# Altium schematic sheet PCIE-to-USB3.SchDoc
size A3
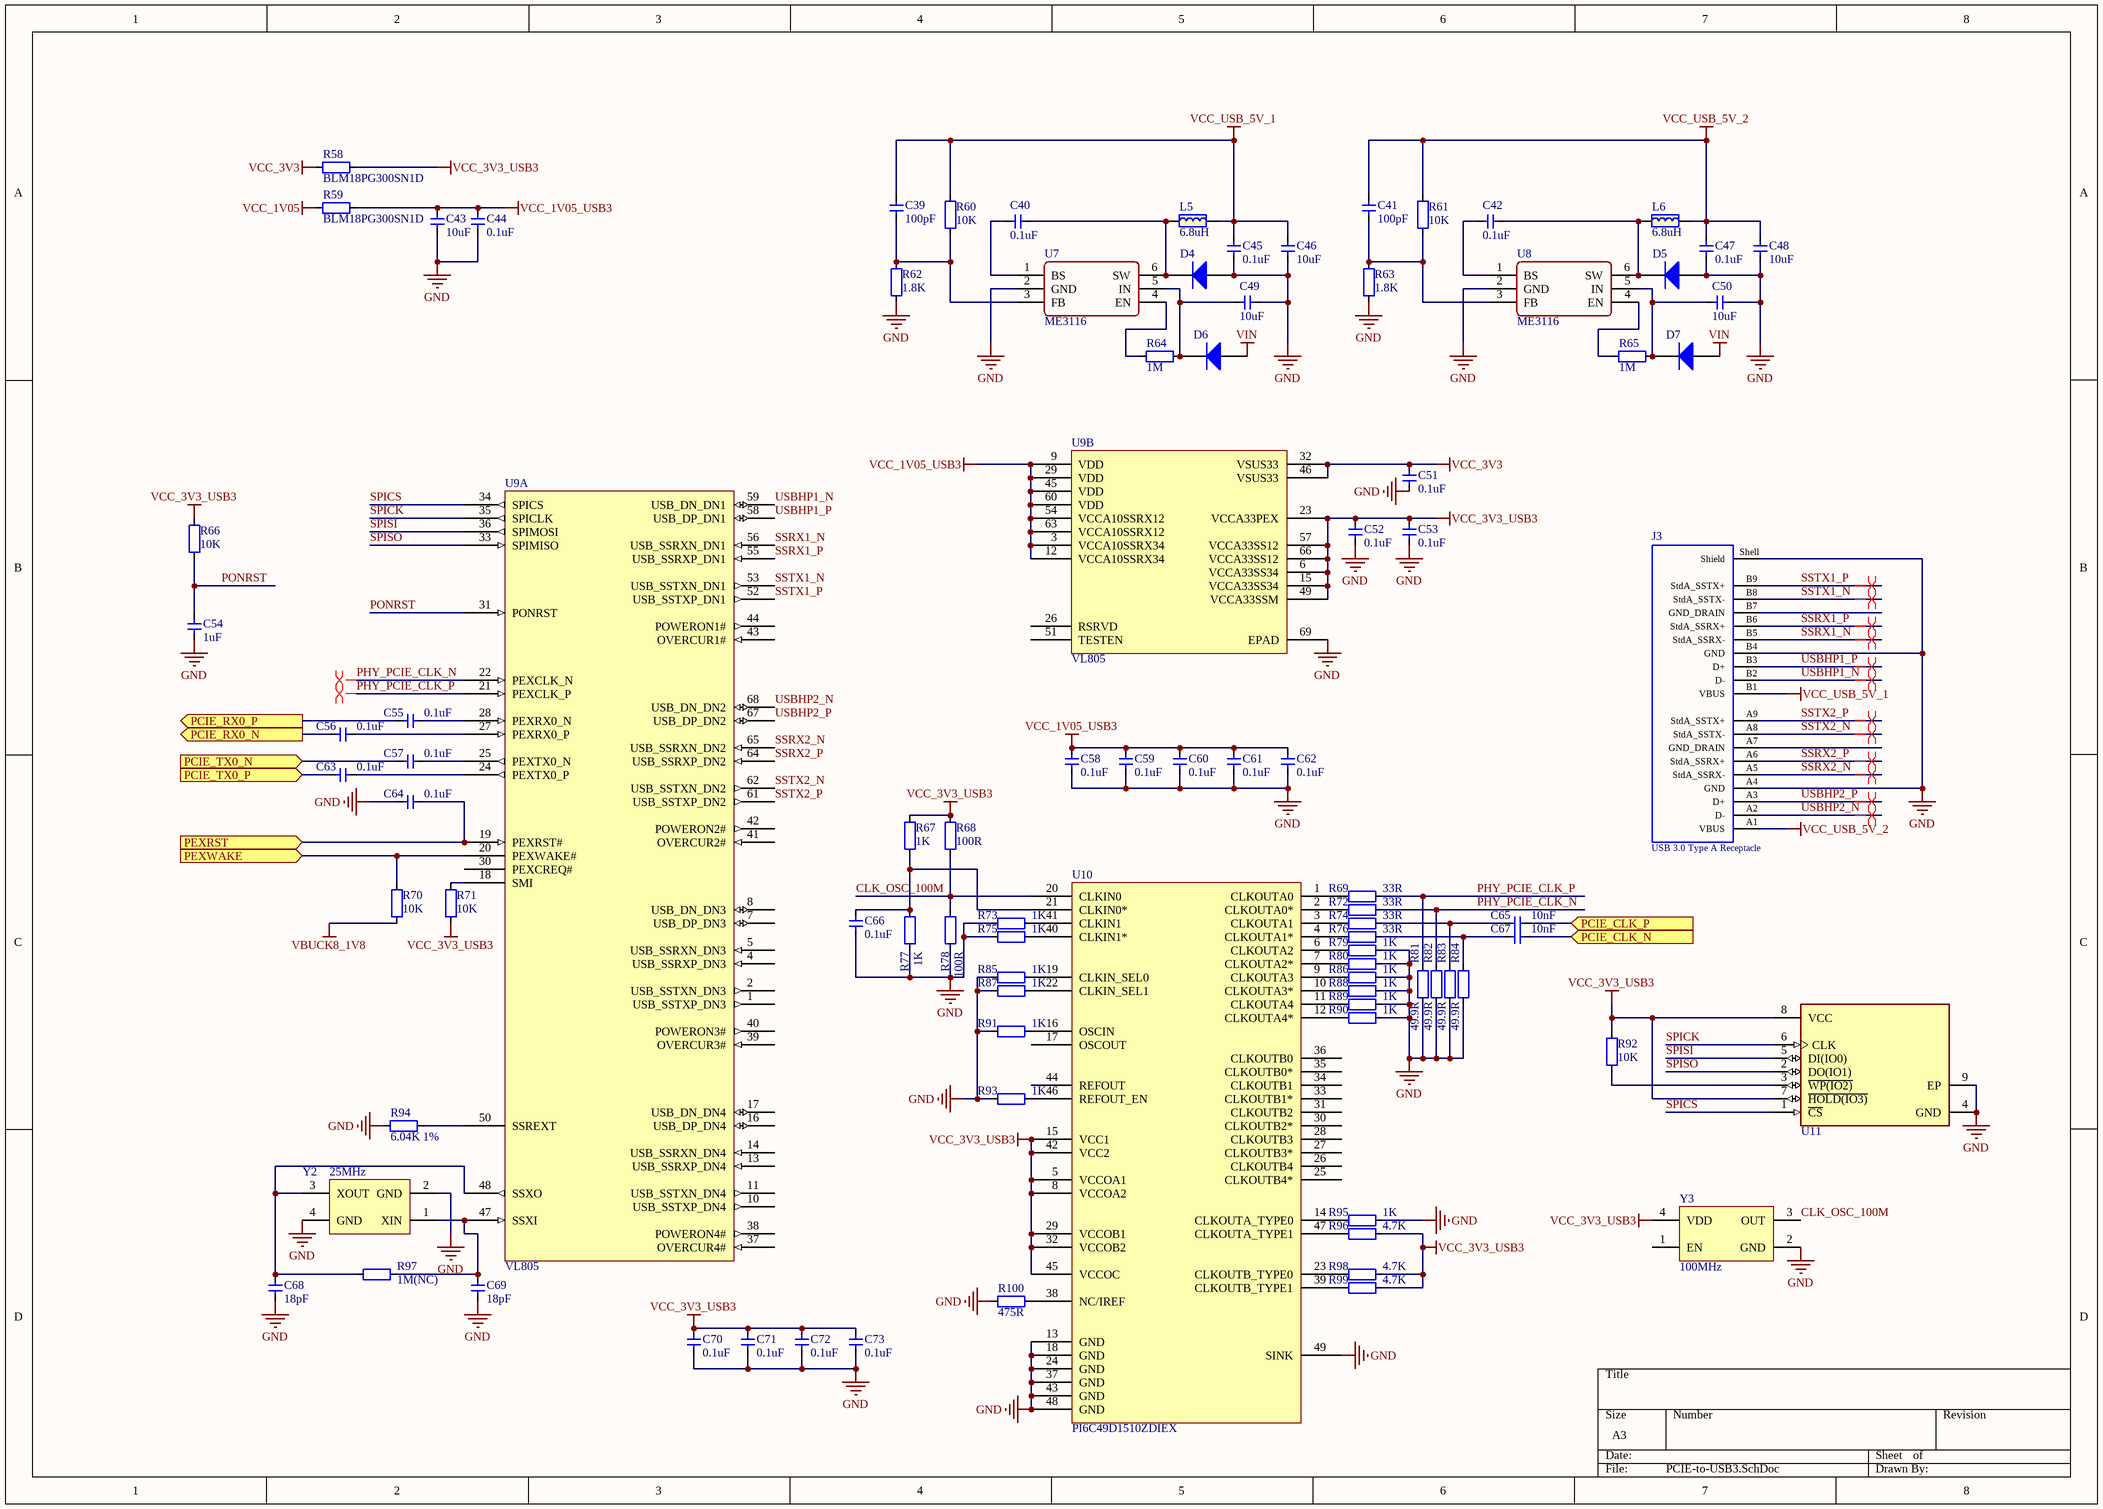
[diagram p0: PCIE-to-USB3.SchDoc]

## Parts
C39  100pF  [CAP_0402]
C40  0.1uF  [CAP_0402]
C41  100pF  [CAP_0402]
C42  0.1uF  [CAP_0402]
C43  10uF  [CAP_0402]
C44  0.1uF  [CAP_0402]
C45  0.1uF  [CAP_0402]
C46  10uF  [CAP_0402]
C47  0.1uF  [CAP_0402]
C48  10uF  [CAP_0402]
C49  10uF  [CAP_0402]
C50  10uF  [CAP_0402]
C51  0.1uF  [CAP_0402]
C52  0.1uF  [CAP_0402]
C53  0.1uF  [CAP_0402]
C54  1uF  [CAP_0402]
C55  0.1uF  [CAP_0402]
C56  0.1uF  [CAP_0402]
C57  0.1uF  [CAP_0402]
C58  0.1uF  [CAP_0402]
C59  0.1uF  [CAP_0402]
C60  0.1uF  [CAP_0402]
C61  0.1uF  [CAP_0402]
C62  0.1uF  [CAP_0402]
C63  0.1uF  [CAP_0402]
C64  0.1uF  [CAP_0402]
C65  10nF  [CAP_0402]
C66  0.1uF  [CAP_0402]
C67  10nF  [CAP_0402]
C68  18pF  [CAP_0402]
C69  18pF  [CAP_0402]
C70  0.1uF  [CAP_0402]
C71  0.1uF  [CAP_0402]
C72  0.1uF  [CAP_0402]
C73  0.1uF  [CAP_0402]
D4  二极管-5B5817WS  [SOD-323]  (value not drawn)
D5  二极管-5B5817WS  [SOD-323]  (value not drawn)
D6  二极管-5B5817WS  [SOD-323]  (value not drawn)
D7  二极管-5B5817WS  [SOD-323]  (value not drawn)
J3  USB 3.0 Type A Receptacle  [692141030100]
L5  6.8uH  [IND-201612]
L6  6.8uH  [IND-201612]
R58  BLM18PG300SN1D  [0603-RES]
R59  BLM18PG300SN1D  [0603-RES]
R60  10K  [RES_0402]
R61  10K  [RES_0402]
R62  1.8K  [RES_0402]
R63  1.8K  [RES_0402]
R64  1M  [RES_0402]
R65  1M  [RES_0402]
R66  10K  [RES_0402]
R67  1K  [RES_0402]
R68  100R  [RES_0402]
R69  33R  [RES_0402]
R70  10K  [RES_0402]
R71  10K  [RES_0402]
R72  33R  [RES_0402]
R73  1K  [RES_0402]
R74  33R  [RES_0402]
R75  1K  [RES_0402]
R76  33R  [RES_0402]
R77  1K  [RES_0402]
R78  100R  [RES_0402]
R79  1K  [RES_0402]
R80  1K  [RES_0402]
R81  49.9R  [RES_0402]
R82  49.9R  [RES_0402]
R83  49.9R  [RES_0402]
R84  49.9R  [RES_0402]
R85  1K  [RES_0402]
R86  1K  [RES_0402]
R87  1K  [RES_0402]
R88  1K  [RES_0402]
R89  1K  [RES_0402]
R90  1K  [RES_0402]
R91  1K  [RES_0402]
R92  10K  [RES_0402]
R93  1K  [RES_0402]
R94  6.04K 1%  [RES_0402]
R95  1K  [RES_0402]
R96  4.7K  [RES_0402]
R97  1M(NC)  [RES_0402]
R98  4.7K  [RES_0402]
R99  4.7K  [RES_0402]
R100  475R  [RES_0402]
U7  ME3116  [SOT23-6]
U8  ME3116  [SOT23-6]
U9  VL805  [QFN-68-0.4MM]  (parts A,B of 2)
U10  PI6C49D1510ZDIEX  [QFN-48_7X7]
U11  W25Q80DVUXIE_TR  [SPI-FLASH-USON]  (value not drawn)
Y2  25MHz  [晶振2520]
Y3  100MHz  [晶振2520]

## Ports
PCIE_CLK_N (in), PCIE_CLK_P (in), PCIE_RX0_N (out), PCIE_RX0_P (out), PCIE_TX0_N (in), PCIE_TX0_P (in), PEXRST (in), PEXWAKE (in)

## Nets
GND: C43.2 C44.2 C45.1 C46.1 C47.1 C48.1 C49.1 C50.1 C51.1 C52.1 C53.1 C54.2 C58.1 C59.1 C60.1 C61.1 C62.1 C64.1 C66.1 C68.1 C69.1 C70.1 C71.1 C72.1 C73.1 D4.1(A) D5.1(A) J3.A4(GND) J3.B4(GND) J3.Shell(Shield) R62.1 R63.1 R73.2 R75.2 R77.1 R78.1 R79.1 R80.1 R81.2 R82.2 R83.2 R84.2 R85.2 R86.1 R87.2 R88.1 R89.1 R90.1 R91.2 R93.2 R94.1 R95.1 R100.1 U7.2(GND) U8.2(GND) U9.69(EPAD) U10.13(GND) U10.18(GND) U10.24(GND) U10.37(GND) U10.43(GND) U10.48(GND) U10.49(SINK) U11.4(GND) U11.9(EP) Y2.2(GND) Y2.4(GND) Y3.2(GND)
VBUCK8_1V8: R70.1
VCC_1V05: R59.1
VCC_1V05_USB3: C43.1 C44.1 C58.2 C59.2 C60.2 C61.2 C62.2 R59.2 U9.3(VCCA10SSRX34) U9.9(VDD) U9.12(VCCA10SSRX34) U9.29(VDD) U9.45(VDD) U9.54(VCCA10SSRX12) U9.60(VDD) U9.63(VCCA10SSRX12)
VCC_3V3: C51.2 R58.1 U9.32(VSUS33) U9.46(VSUS33)
VCC_3V3_USB3: C52.2 C53.2 C70.2 C71.2 C72.2 C73.2 R58.2 R66.2 R67.2 R68.2 R71.1 R92.1 R96.1 R98.1 R99.1 U9.6(VCCA33SS34) U9.15(VCCA33SS34) U9.23(VCCA33PEX) U9.49(VCCA33SSM) U9.57(VCCA33SS12) U9.66(VCCA33SS12) U10.5(VCCOA1) U10.8(VCCOA2) U10.15(VCC1) U10.29(VCCOB1) U10.32(VCCOB2) U10.42(VCC2) U10.45(VCCOC) U11.7(~{HOLD(IO3)}) U11.8(VCC) Y3.4(VDD)
VCC_USB_5V_1: C39.1 C45.2 C46.2 J3.B1(VBUS) L5.2 R60.2
VCC_USB_5V_2: C41.1 C47.2 C48.2 J3.A1(VBUS) L6.2 R61.2
VIN: D6.1(A) D7.1(A)
CLK_OSC_100M: R68.1 R78.2 U10.20(CLKIN0) Y3.3(OUT)
PCIE_CLK_N: C67.1 ; port PCIE_CLK_N
PCIE_CLK_P: C65.1 ; port PCIE_CLK_P
PCIE_RX0_N: C56.1 ; port PCIE_RX0_N
PCIE_RX0_P: C55.1 ; port PCIE_RX0_P
PCIE_TX0_N: C57.1 ; port PCIE_TX0_N
PCIE_TX0_P: C63.1 ; port PCIE_TX0_P
PEXRST: C64.2 U9.19(PEXRST#) ; port PEXRST
PEXWAKE: R70.2 U9.20(PEXWAKE#) ; port PEXWAKE
PHY_PCIE_CLK_N: R72.1 R82.1 U9.22(PEXCLK_N)
PHY_PCIE_CLK_P: R69.1 R81.1 U9.21(PEXCLK_P)
PONRST: C54.1 R66.1 U9.31(PONRST)
SPICK: U9.35(SPICLK) U11.6(CLK)
SPICS: U9.34(SPICS) U11.1(~{CS})
SPISI: U9.36(SPIMOSI) U11.5(DI(IO0))
SPISO: U9.33(SPIMISO) U11.2(DO(IO1))
SSRX1_N: J3.B5(StdA_SSRX-) U9.56(USB_SSRXN_DN1)
SSRX1_P: J3.B6(StdA_SSRX+) U9.55(USB_SSRXP_DN1)
SSRX2_N: J3.A5(StdA_SSRX-) U9.65(USB_SSRXN_DN2)
SSRX2_P: J3.A6(StdA_SSRX+) U9.64(USB_SSRXP_DN2)
SSTX1_N: J3.B8(StdA_SSTX-) U9.53(USB_SSTXN_DN1)
SSTX1_P: J3.B9(StdA_SSTX+) U9.52(USB_SSTXP_DN1)
SSTX2_N: J3.A8(StdA_SSTX-) U9.62(USB_SSTXN_DN2)
SSTX2_P: J3.A9(StdA_SSTX+) U9.61(USB_SSTXP_DN2)
USBHP1_N: J3.B2(D-) U9.59(USB_DN_DN1)
USBHP1_P: J3.B3(D+) U9.58(USB_DP_DN1)
USBHP2_N: J3.A2(D-) U9.68(USB_DN_DN2)
USBHP2_P: J3.A3(D+) U9.67(USB_DP_DN2)
NetC39_2: C39.2 R60.1 R62.2 U7.3(FB)
NetC40_1: C40.1 D4.2(K) L5.1 U7.6(SW)
NetC40_2: C40.2 U7.1(BS)
NetC41_2: C41.2 R61.1 R63.2 U8.3(FB)
NetC42_1: C42.1 D5.2(K) L6.1 U8.6(SW)
NetC42_2: C42.2 U8.1(BS)
NetC49_2: C49.2 D6.2(K) R64.1 U7.5(IN)
NetC50_2: C50.2 D7.2(K) R65.1 U8.5(IN)
NetC55_2: C55.2 U9.28(PEXRX0_N)
NetC56_2: C56.2 U9.27(PEXRX0_P)
NetC57_2: C57.2 U9.25(PEXTX0_N)
NetC63_2: C63.2 U9.24(PEXTX0_P)
NetC65_2: C65.2 R74.1 R83.1
NetC66_2: C66.2 R67.1 R77.2 U10.21(CLKIN0*)
NetC67_2: C67.2 R76.1 R84.1
NetC68_2: C68.2 R97.2 U9.48(SSXO) Y2.3(XOUT)
NetC69_2: C69.2 R97.1 U9.47(SSXI) Y2.1(XIN)
NetR64_2: R64.2 U7.4(EN)
NetR65_2: R65.2 U8.4(EN)
NetR69_2: R69.2 U10.1(CLKOUTA0)
NetR71_2: R71.2 U9.18(SMI)
NetR72_2: R72.2 U10.2(CLKOUTA0*)
NetR73_1: R73.1 U10.41(CLKIN1)
NetR74_2: R74.2 U10.3(CLKOUTA1)
NetR75_1: R75.1 U10.40(CLKIN1*)
NetR76_2: R76.2 U10.4(CLKOUTA1*)
NetR79_2: R79.2 U10.6(CLKOUTA2)
NetR80_2: R80.2 U10.7(CLKOUTA2*)
NetR85_1: R85.1 U10.19(CLKIN_SEL0)
NetR86_2: R86.2 U10.9(CLKOUTA3)
NetR87_1: R87.1 U10.22(CLKIN_SEL1)
NetR88_2: R88.2 U10.10(CLKOUTA3*)
NetR89_2: R89.2 U10.11(CLKOUTA4)
NetR90_2: R90.2 U10.12(CLKOUTA4*)
NetR91_1: R91.1 U10.16(OSCIN)
NetR92_2: R92.2 U11.3(~{WP(IO2)})
NetR93_1: R93.1 U10.46(REFOUT_EN)
NetR94_2: R94.2 U9.50(SSREXT)
NetR95_2: R95.2 U10.14(CLKOUTA_TYPE0)
NetR96_2: R96.2 U10.47(CLKOUTA_TYPE1)
NetR98_2: R98.2 U10.23(CLKOUTB_TYPE0)
NetR99_2: R99.2 U10.39(CLKOUTB_TYPE1)
NetR100_2: R100.2 U10.38(NC/IREF)

Not connected (* = marked no-connect by the designer): J3 A7(GND_DRAIN) B7(GND_DRAIN); U9 1(USB_SSTXP_DN3) 2(USB_SSTXN_DN3) 4(USB_SSRXP_DN3) 5(USB_SSRXN_DN3) 7(USB_DP_DN3) 8(USB_DN_DN3) 10(USB_SSTXP_DN4) 11(USB_SSTXN_DN4) 13(USB_SSRXP_DN4) 14(USB_SSRXN_DN4) 16(USB_DP_DN4) 17(USB_DN_DN4) 26(RSRVD) 30(PEXCREQ#) 37(OVERCUR4#) 38(POWERON4#) 39(OVERCUR3#) 40(POWERON3#) 41(OVERCUR2#) 42(POWERON2#) 43(OVERCUR1#) 44(POWERON1#) 51(TESTEN); U10 17(OSCOUT) 25(CLKOUTB4*) 26(CLKOUTB4) 27(CLKOUTB3*) 28(CLKOUTB3) 30(CLKOUTB2*) 31(CLKOUTB2) 33(CLKOUTB1*) 34(CLKOUTB1) 35(CLKOUTB0*) 36(CLKOUTB0) 44(REFOUT); Y3 1(EN)

## Layout directives
differential pair: PHY_PCIE_CLK_N, PHY_PCIE_CLK_P, SSRX1_N, SSRX1_P, SSRX2_N, SSRX2_P, SSTX1_N, SSTX1_P, SSTX2_N, SSTX2_P, USBHP1_N, USBHP1_P, USBHP2_N, USBHP2_P

## Library data of the parts
C39-C73 = 电容-0402: Capacitor; Value: 0.1u
D4-D7 = 二极管-5B5817WS: 40V
J3 = 692141030100: USB 3.0 Type A, Receptacle, Horizontal, THR, Dual Stacked; Manufacturer: Wurth Elektronik; Rated Current: 1.8A; Pin Number: 18; Interface Type: Type A; Working Voltage: 30VAC; ComponentLink1Description: Manufacturer; ComponentLink1URL: http://www.we-online.de; ComponentLink2Description: Datasheet; ComponentLink2URL: https://katalog.we-online.com/em/datasheet/692141030100.pdf; Published Date: August 2020; Manufacturer Part Number: 692141030100; Gender: Receptacle; Type: Horizontal; Packaging: Tray; Operating Temperature: -40 to +85degC; Mounting Technology: THR; Application: USB 3.0
L5 L6 = 电感-201612
R58 R59 = 电阻-0603: Resistor; Value: 22R
R60-R100 = 电阻-0402: Resistor; Value: 22R
U7 U8 = ME3116: DC-DC
U9 = VL805: PCIE to USB3.0
Y2 = 晶振-4Pin-无源: 2520无源; MF: ECS International; MP: ECS-3225S30-240-EN-TR; Package: SMD-6 ECS International; Price: 0.75 USD; Availability: Unavailable; Value: *
Y3 = 晶振-4Pin-有源: 2520